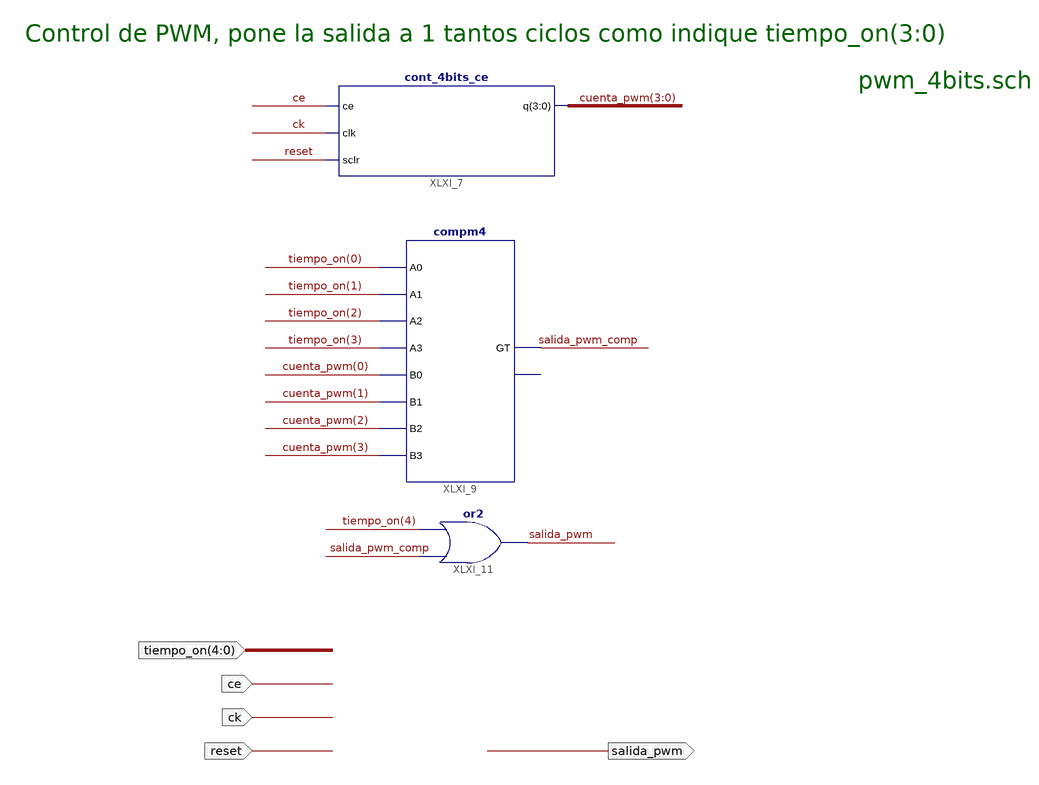
[diagram p0: schematic sheet 1]
// Xilinx ISE schematic pwm_4bits.sch (spartan6) as structural Verilog: 3 symbols, 5 ports
module pwm_4bits (
  input  ce,
  input  ck,
  input  reset,
  input  [4:0] tiempo_on,
  output salida_pwm
);

  wire salida_pwm_comp;
  wire [3:0] cuenta_pwm;

  cont_4bits_ce XLXI_7 (.sclr(reset), .q(cuenta_pwm), .clk(ck), .ce(ce));
  compm4 XLXI_9 (
    .A0(tiempo_on[0]), .A1(tiempo_on[1]), .A2(tiempo_on[2]), .A3(tiempo_on[3]), .B0(cuenta_pwm[0]),
    .B1(cuenta_pwm[1]), .B2(cuenta_pwm[2]), .B3(cuenta_pwm[3]), .GT(salida_pwm_comp));  // open: LT
  or XLXI_11 (salida_pwm, salida_pwm_comp, tiempo_on[4]);

  // Notes on the sheet:
  //   Control de PWM, pone la salida a 1 tantos ciclos como indique tiempo_on(3:0)
  //   pwm_4bits.sch
endmodule
